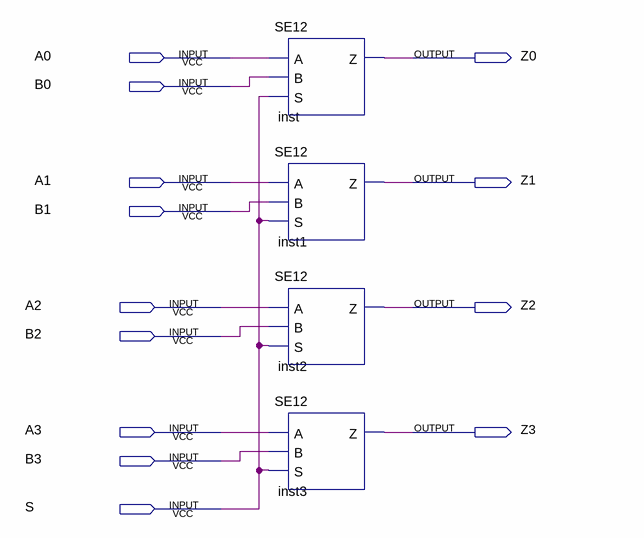
[diagram p0: schematic sheet]
// Quartus schematic QUADSE12.bdf as structural Verilog: 4 symbols, 13 pins
module QUADSE12 (
  input  A0,
  input  B0,
  input  A1,
  input  B1,
  input  A2,
  input  B2,
  input  A3,
  input  B3,
  input  S,
  output Z0,
  output Z1,
  output Z2,
  output Z3
);

  SE12 inst (.A(A0), .B(B0), .S(S), .Z(Z0));
  SE12 inst1 (.A(A1), .B(B1), .S(S), .Z(Z1));
  SE12 inst2 (.A(A2), .B(B2), .S(S), .Z(Z2));
  SE12 inst3 (.A(A3), .B(B3), .S(S), .Z(Z3));
endmodule
